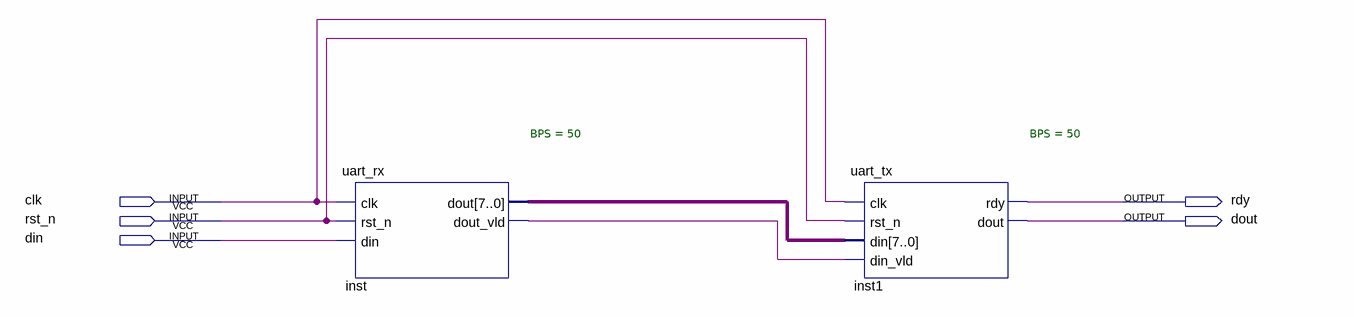
[diagram p0: schematic sheet]
// Quartus schematic UART.bdf as structural Verilog: 2 symbols, 5 pins
module UART (
  input  clk,
  input  rst_n,
  input  din,
  output rdy,
  output dout
);

  wire inst_dout_vld;
  wire [7:0] inst_dout;

  uart_rx #(.BPS(50)) inst (.clk(clk), .rst_n(rst_n), .din(din), .dout(inst_dout), .dout_vld(inst_dout_vld));
  uart_tx #(.BPS(50)) inst1 (
    .clk(clk), .rst_n(rst_n), .din(inst_dout), .din_vld(inst_dout_vld), .rdy(rdy), .dout(dout));
endmodule
